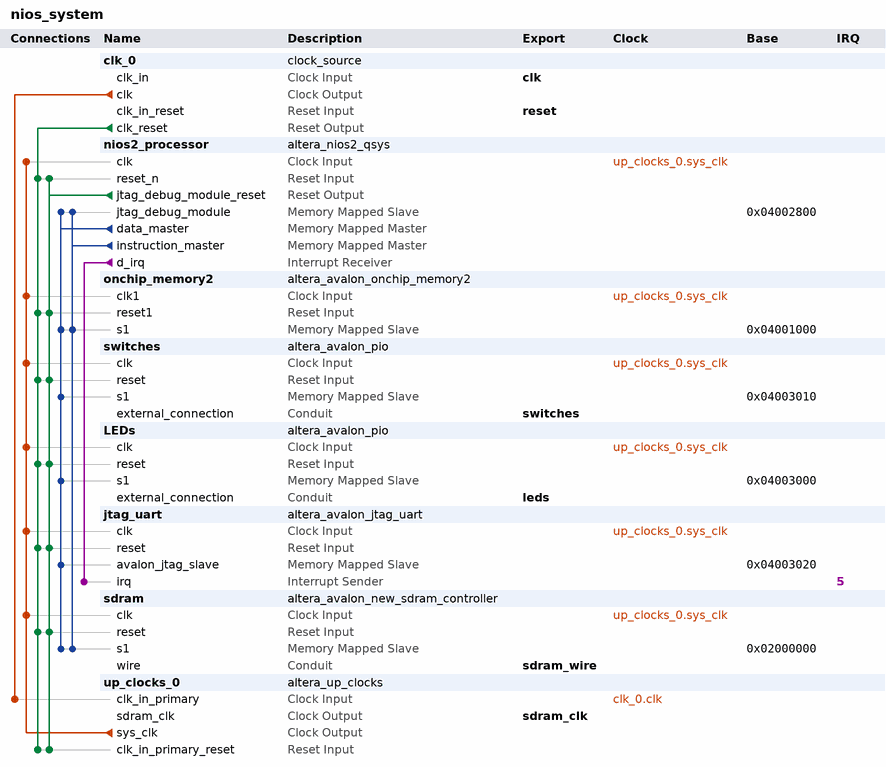
[diagram p0: system contents]
# Platform Designer (Qsys) system nios_system, Cyclone IV E EP4CE22F17C6
# Parameters at their usual value, and those the tool derives, are not listed.
package require -exact qsys 13.0.1.99.2
create_system nios_system
set_project_property DEVICE_FAMILY {Cyclone IV E}
set_project_property DEVICE EP4CE22F17C6

add_instance clk_0 clock_source 13.0
set_instance_parameter_value clk_0 clockFrequency 50000000

add_instance nios2_processor altera_nios2_qsys 13.0
set_instance_parameter_value nios2_processor resetSlave sdram.s1
set_instance_parameter_value nios2_processor mmu_TLBMissExcSlave None
set_instance_parameter_value nios2_processor exceptionSlave sdram.s1
set_instance_parameter_value nios2_processor breakSlave nios2_processor.jtag_debug_module
set_instance_parameter_value nios2_processor impl Tiny
set_instance_parameter_value nios2_processor icache_size 4096

add_instance onchip_memory2 altera_avalon_onchip_memory2 13.0.1.99.2
set_instance_parameter_value onchip_memory2 dataWidth 32
set_instance_parameter_value onchip_memory2 dualPort false
set_instance_parameter_value onchip_memory2 initMemContent true
set_instance_parameter_value onchip_memory2 initializationFileName onchip_mem.hex
set_instance_parameter_value onchip_memory2 memorySize 4096

add_instance switches altera_avalon_pio 13.0.1.99.2
set_instance_parameter_value switches direction Input
set_instance_parameter_value switches width 8

add_instance LEDs altera_avalon_pio 13.0.1.99.2
set_instance_parameter_value LEDs direction Output
set_instance_parameter_value LEDs width 8

add_instance jtag_uart altera_avalon_jtag_uart 13.0.1.99.2
set_instance_parameter_value jtag_uart simInteractiveOptions NO_INTERACTIVE_WINDOWS

add_instance sdram altera_avalon_new_sdram_controller 13.0.1.99.2
set_instance_parameter_value sdram TAC 5.5
set_instance_parameter_value sdram TRCD 20.0
set_instance_parameter_value sdram TRP 20.0
set_instance_parameter_value sdram casLatency 3
set_instance_parameter_value sdram columnWidth 9
set_instance_parameter_value sdram dataWidth 16
set_instance_parameter_value sdram generateSimulationModel false
set_instance_parameter_value sdram model single_Micron_MT48LC4M32B2_7_chip
set_instance_parameter_value sdram numberOfBanks 4
set_instance_parameter_value sdram numberOfChipSelects 1
set_instance_parameter_value sdram powerUpDelay 100.0
set_instance_parameter_value sdram refreshPeriod 15.625
set_instance_parameter_value sdram rowWidth 13

add_instance up_clocks_0 altera_up_clocks 13.0
set_instance_parameter_value up_clocks_0 board DE0-Nano
set_instance_parameter_value up_clocks_0 vga_clk false
set_instance_parameter_value up_clocks_0 audio_clk false
set_instance_parameter_value up_clocks_0 audio_clk_freq 12.288

# connections
add_connection clk_0.clk up_clocks_0.clk_in_primary clock
add_connection up_clocks_0.sys_clk jtag_uart.clk clock
add_connection up_clocks_0.sys_clk LEDs.clk clock
add_connection up_clocks_0.sys_clk nios2_processor.clk clock
add_connection up_clocks_0.sys_clk onchip_memory2.clk1 clock
add_connection up_clocks_0.sys_clk sdram.clk clock
add_connection up_clocks_0.sys_clk switches.clk clock
add_connection clk_0.clk_reset jtag_uart.reset reset
add_connection clk_0.clk_reset LEDs.reset reset
add_connection clk_0.clk_reset nios2_processor.reset_n reset
add_connection clk_0.clk_reset onchip_memory2.reset1 reset
add_connection clk_0.clk_reset sdram.reset reset
add_connection clk_0.clk_reset switches.reset reset
add_connection clk_0.clk_reset up_clocks_0.clk_in_primary_reset reset
add_connection nios2_processor.jtag_debug_module_reset jtag_uart.reset reset
add_connection nios2_processor.jtag_debug_module_reset LEDs.reset reset
add_connection nios2_processor.jtag_debug_module_reset nios2_processor.reset_n reset
add_connection nios2_processor.jtag_debug_module_reset onchip_memory2.reset1 reset
add_connection nios2_processor.jtag_debug_module_reset sdram.reset reset
add_connection nios2_processor.jtag_debug_module_reset switches.reset reset
add_connection nios2_processor.jtag_debug_module_reset up_clocks_0.clk_in_primary_reset reset
add_connection nios2_processor.data_master jtag_uart.avalon_jtag_slave avalon
set_connection_parameter_value nios2_processor.data_master/jtag_uart.avalon_jtag_slave baseAddress 0x04003020
add_connection nios2_processor.data_master LEDs.s1 avalon
set_connection_parameter_value nios2_processor.data_master/LEDs.s1 baseAddress 0x04003000
add_connection nios2_processor.data_master nios2_processor.jtag_debug_module avalon
set_connection_parameter_value nios2_processor.data_master/nios2_processor.jtag_debug_module baseAddress 0x04002800
add_connection nios2_processor.data_master onchip_memory2.s1 avalon
set_connection_parameter_value nios2_processor.data_master/onchip_memory2.s1 baseAddress 0x04001000
add_connection nios2_processor.data_master sdram.s1 avalon
set_connection_parameter_value nios2_processor.data_master/sdram.s1 baseAddress 0x02000000
add_connection nios2_processor.data_master switches.s1 avalon
set_connection_parameter_value nios2_processor.data_master/switches.s1 baseAddress 0x04003010
add_connection nios2_processor.instruction_master nios2_processor.jtag_debug_module avalon
set_connection_parameter_value nios2_processor.instruction_master/nios2_processor.jtag_debug_module baseAddress 0x04002800
add_connection nios2_processor.instruction_master onchip_memory2.s1 avalon
set_connection_parameter_value nios2_processor.instruction_master/onchip_memory2.s1 baseAddress 0x04001000
add_connection nios2_processor.instruction_master sdram.s1 avalon
set_connection_parameter_value nios2_processor.instruction_master/sdram.s1 baseAddress 0x02000000
add_connection nios2_processor.d_irq jtag_uart.irq interrupt
set_connection_parameter_value nios2_processor.d_irq/jtag_uart.irq irqNumber 5

# exported interfaces
add_interface clk clock sink
set_interface_property clk EXPORT_OF clk_0.clk_in
add_interface reset reset sink
set_interface_property reset EXPORT_OF clk_0.clk_in_reset
add_interface switches conduit end
set_interface_property switches EXPORT_OF switches.external_connection
add_interface leds conduit end
set_interface_property leds EXPORT_OF LEDs.external_connection
add_interface sdram_wire conduit end
set_interface_property sdram_wire EXPORT_OF sdram.wire
add_interface sdram_clk clock source
set_interface_property sdram_clk EXPORT_OF up_clocks_0.sdram_clk

set_interconnect_requirement {$system} qsys_mm.clockCrossingAdapter HANDSHAKE
set_interconnect_requirement {$system} qsys_mm.maxAdditionalLatency 1

save_system nios_system.qsys
